# EAGLE design power-module (EAGLE 8.3.1)
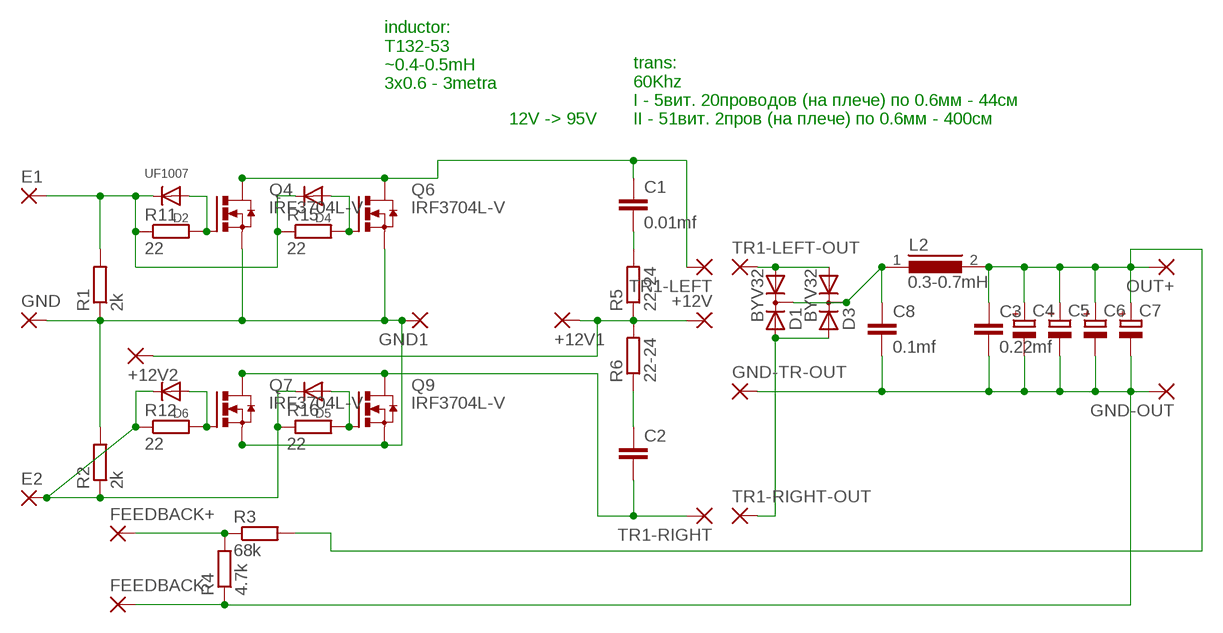
[diagram p0: schematic, sheet 1]

## Parts
+12V  3,81/1,1  [3,81/1,1]
+12V1  3,81/1,1  [3,81/1,1]
+12V2  3,81/1,1  [3,81/1,1]
C1  0.01mf  C-EU102-064X133  [C102-064X133]
C2  C-EU102-064X133  [C102-064X133]
C3  0.22mf  C-EU150-064X183  [C150-064X183]
C4  CPOL-EUE10-22.5  [EB22,5D]
C5  CPOL-EUE10-22.5  [EB22,5D]
C6  CPOL-EUE10-22.5  [EB22,5D]
C7  CPOL-EUE10-22.5  [EB22,5D]
C8  0.1mf  C-EU150-064X183  [C150-064X183]
D1  BYV32  [TO220ABS]
D2  UF1007  DIODEDO-1N4148  [DO-1N4148]
D3  BYV32  [TO220ABS]
D4  DIODEDO-1N4148  [DO-1N4148]
D5  DIODEDO-1N4148  [DO-1N4148]
D6  DIODEDO-1N4148  [DO-1N4148]
E1  3,81/1,1  [3,81/1,1]
E2  3,81/1,1  [3,81/1,1]
FEEDBACK+  3,81/1,1  [3,81/1,1]
FEEDBACK-  3,81/1,1  [3,81/1,1]
GND  3,81/1,1  [3,81/1,1]
GND1  3,81/1,1  [3,81/1,1]
GND-OUT  3,81/1,1  [3,81/1,1]
GND-TR-OUT  3,81/1,1  [3,81/1,1]
L2  0.3-0.7mH  R2711F11  [11-27]
OUT+  3,81/1,1  [3,81/1,1]
Q4  IRF3704L-V  [TO262-V]
Q6  IRF3704L-V  [TO262-V]
Q7  IRF3704L-V  [TO262-V]
Q9  IRF3704L-V  [TO262-V]
R1  2k  R-EU_0204/7  [0204/7]
R2  2k  R-EU_0204/7  [0204/7]
R3  68k  R-EU_0617/17  [0617/17]
R4  4.7k  R-EU_0617/17  [0617/17]
R5  22-24  R-EU_0613/15  [P0613/15]
R6  22-24  R-EU_0613/15  [P0613/15]
R11  22  R-EU_0204/7  [0204/7]
R12  22  R-EU_0204/7  [0204/7]
R15  22  R-EU_0204/7  [0204/7]
R16  22  R-EU_0204/7  [0204/7]
TR1-LEFT  3,81/1,1  [3,81/1,1]
TR1-LEFT-OUT  3,81/1,1  [3,81/1,1]
TR1-RIGHT  3,81/1,1  [3,81/1,1]
TR1-RIGHT-OUT  3,81/1,1  [3,81/1,1]

## Nets
N$1: GND1.1(P) GND.1(P) Q4.3(S) Q6.3(S) Q7.3(S) Q9.3(S) R1.1 R2.2
N$2: C1.1 Q4.2(D) Q6.2(D) TR1-LEFT.1(P)
N$3: D5.C D6.C E2.1(P) R2.1 R12.1 R16.1
N$4: FEEDBACK+.1(P) R3.1 R4.2
N$5: +12V1.1(P) +12V2.1(P) +12V.1(P) R5.1 R6.2
N$6: C3.2 C4.- C5.- C6.- C7.- C8.2 FEEDBACK-.1(P) GND-OUT.1(P) GND-TR-OUT.1(P) R4.1
N$7: C2.2 Q7.2(D) Q9.2(D) TR1-RIGHT.1(P)
N$9: D2.C D4.C E1.1(P) R1.2 R11.1 R15.1
N$11: C1.2 R5.2
N$12: D1.A2 D3.A2 TR1-RIGHT-OUT.1(P)
N$13: C2.1 R6.1
N$14: D1.A1 D3.A1 TR1-LEFT-OUT.1(P)
N$15: C8.1 D1.C D3.C L2.1
N$17: C3.1 C4.+ C5.+ C6.+ C7.+ L2.2 OUT+.1(P) R3.2
N$18: D2.A Q4.1(G) R11.2
N$19: D6.A Q7.1(G) R12.2
N$22: D4.A Q6.1(G) R15.2
N$23: D5.A Q9.1(G) R16.2

## Notes on the sheet
- inductor:
  T132-53
  ~0.4-0.5mH
  3x0.6 - 3metra
- 12V -> 95V
- trans:
  60Khz
  I - 5вит. 20проводов (на плече) по 0.6мм - 44см
  II - 51вит. 2пров (на плече) по 0.6мм - 400см

## Library data of the parts
+12V +12V1 +12V2 E1 E2 FEEDBACK+ FEEDBACK- GND GND1 GND-OUT GND-TR-OUT OUT+ TR1-LEFT TR1-LEFT-OUT TR1-RIGHT TR1-RIGHT-OUT = wirepad:3,81/1,1: THROUGH-HOLE PAD
C1-C3 C8 = resistor:C-EU: CAPACITOR, European symbol
C4-C7 = resistor:CPOL-EU: POLARIZED CAPACITOR, European symbol
D1 D3 = diode:BYV32: DIODE 2 x Si diode 200 V, 20 A/230 Apeak, 25 ns
D2 D4-D6 = adafruit:DIODE: Diode SMADIODE - SMA Surface Mount Package 20V 1A Schottky Diode Digikey: 641-1014-6-ND DO-1N4148 - Through Hole Small Current Diode SOD-123 20V 1 A (.5mV Vf) Schottky Diode - Digikey: MBRX120TPMSCT-ND SOD-323 10V 570mA (.38mV Vf, 3ns) Schottky Diode - Digikey: ZLLS410CT-ND SOD-523 30V 30mA Schottky Diode (RB751S-40TE61) - Digikey: RB751S-40TE61CT-ND SOT23-R/W - SOT23 Package (R = Solder Paste/Reflow Ovens, W = Hand-Soldering) BAT54Film 40V 300mA - Digikey: 497-7162-1-ND
L2 = inductor-nkl:R2711F: Gegentakt-Entstördrossel differential mode choke; OC_FARNELL: unknown; OC_NEWARK: unknown
Q4 Q6 Q7 Q9 = transistor-power:IRF3704: SMPS MOSFET HEXFET® Power MOSFET Source: http://www.irf.com/product-info/datasheets/data/irf3704.pdf
R1-R6 R11 R12 R15 R16 = resistor:R-EU_: RESISTOR, European symbol

## Board
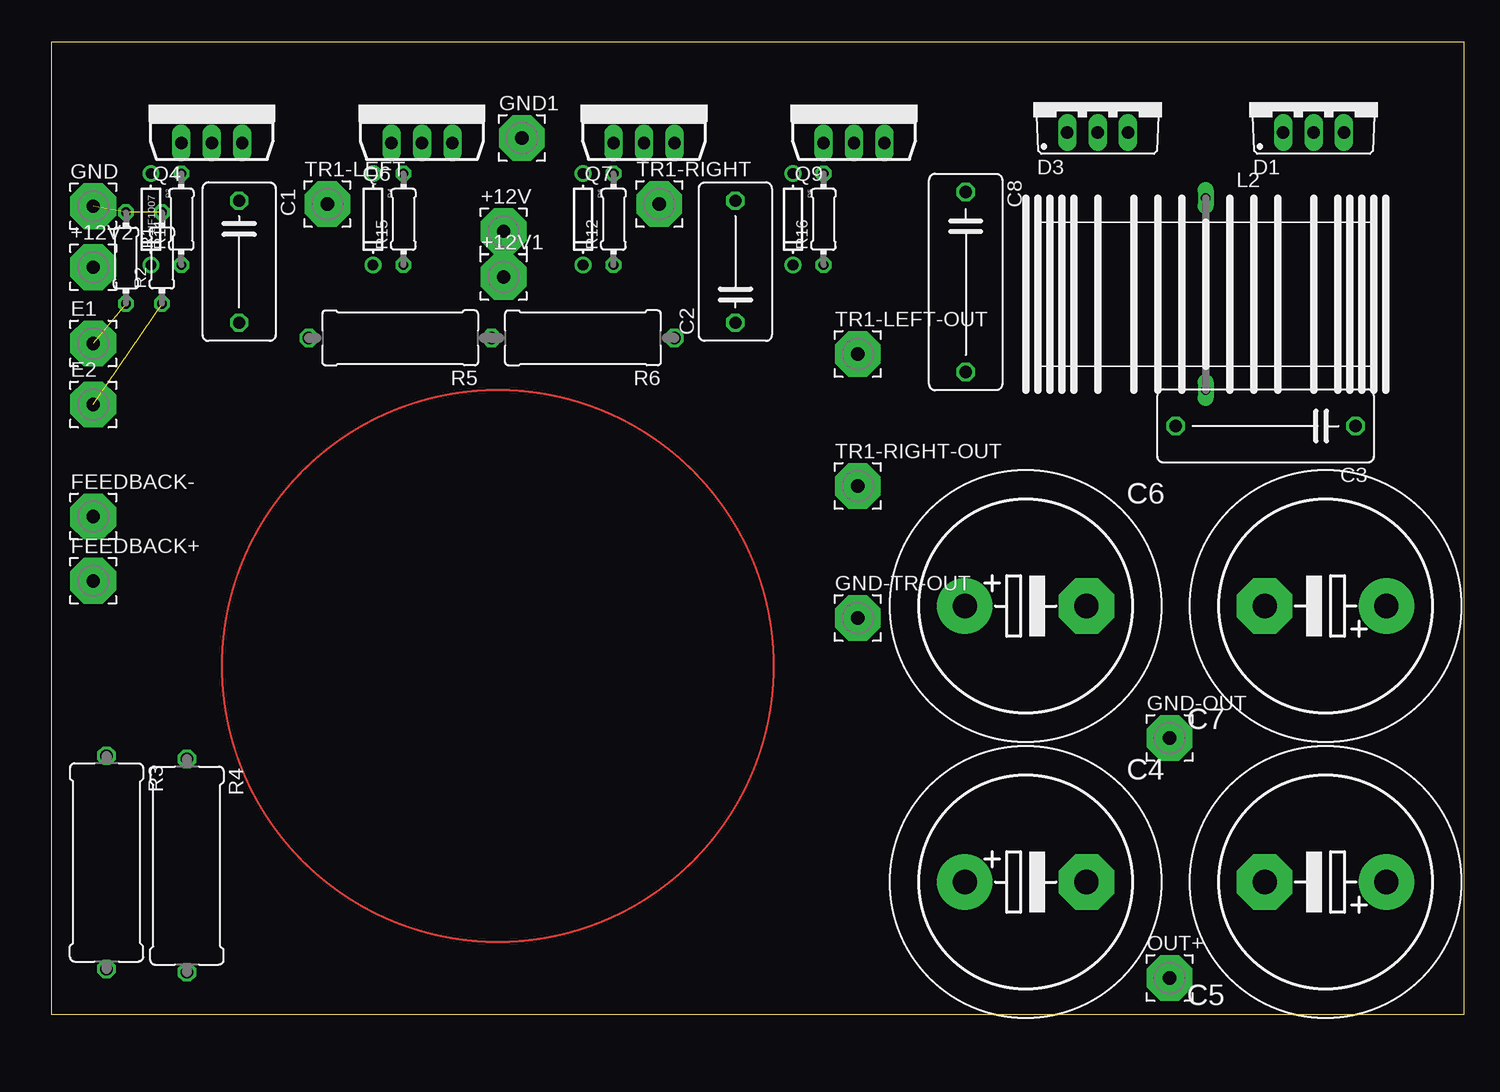
[diagram p1: board, top side]
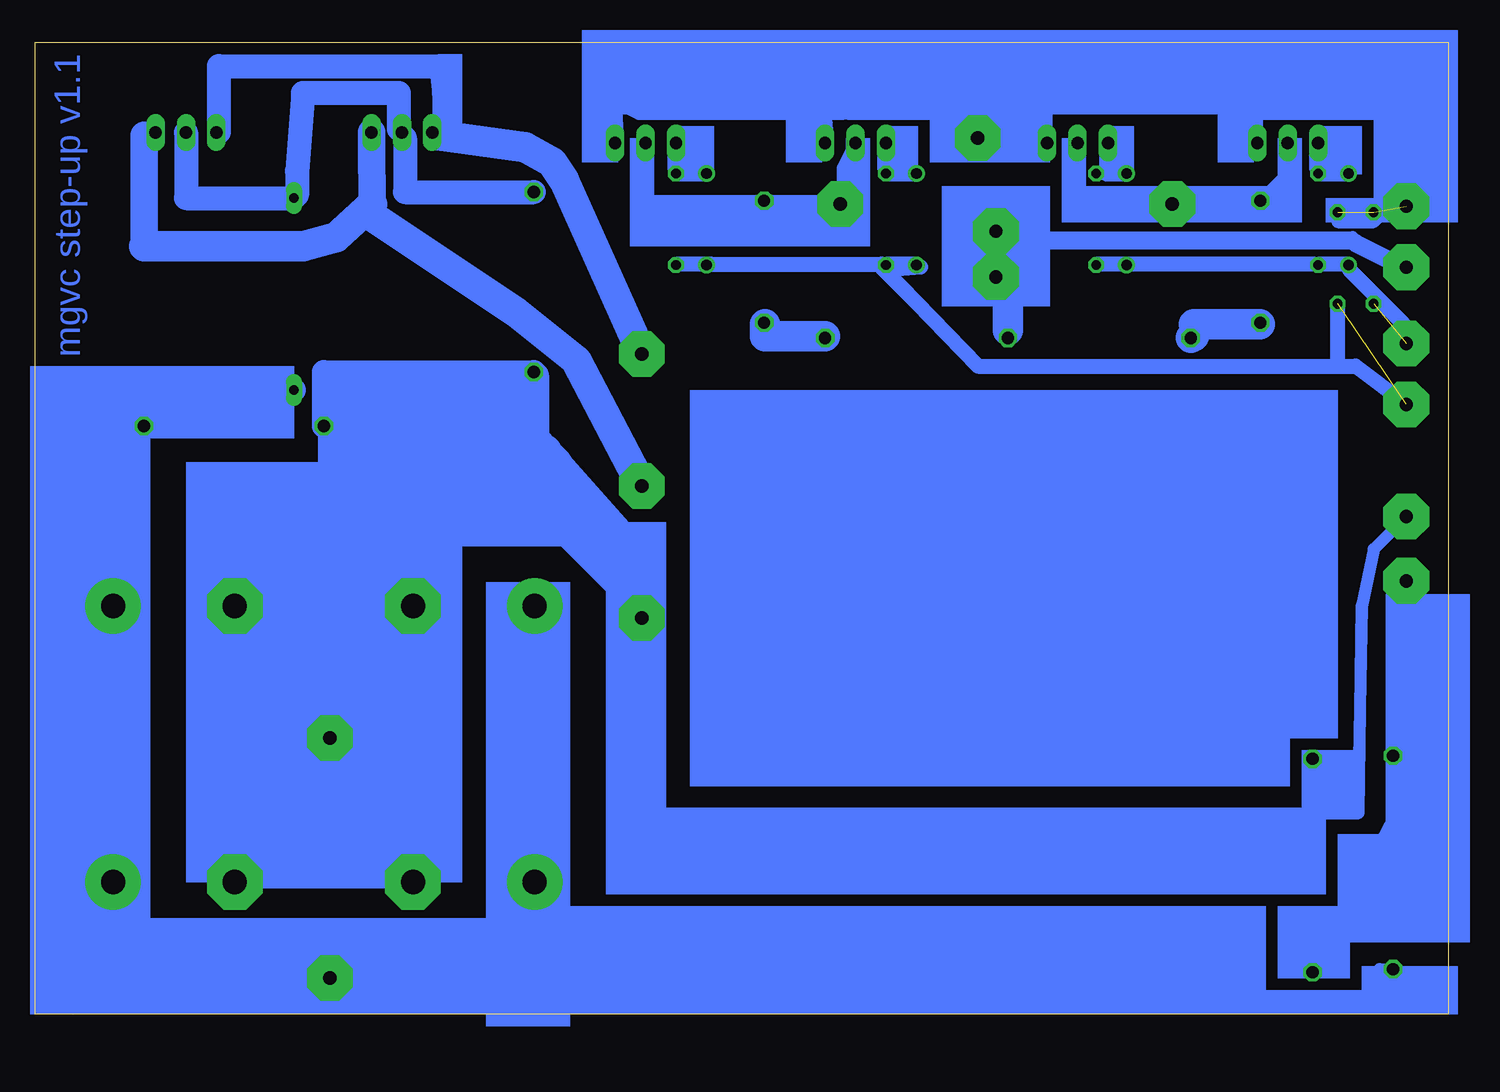
[diagram p2: board, bottom side, seen from below]

Size 117.8 x 81 mm. Coordinates in mm from the lower left corner, seen from the top.
Outline: 0,0 117.8,0 117.8,81 0,81 0,0
Copper layers (1*16): Top 0.035mm / dielectric 1.5mm / Bottom 0.035mm
Design rules "default *": minimum track width 1mm, minimum drill 0.35mm, track to track 6mil, track to pad 6mil, pad to pad 6mil, via to via 6mil, smd to smd 6mil, copper to edge 40mil, drill to drill 6mil, minimum pad ring 10mil, minimum via ring 8mil, stop-mask expansion 4mil, vias tented up to drill 0mil, thermal gap 10mil

### Footprints (pad centres in the part's own frame; a part is rotated, then mirrored left to right if it is on the bottom)
3,81/1,1 = drill 1.118 pad 3.81 octagon: 1 0,0
C102-064X133 = drill 1.016 octagon: 1 -5.08,0; 2 5.08,0
C150-064X183 = drill 1.016 octagon: 1 -7.493,0; 2 7.493,0
EB22,5D = drill 2.007 pad 4.597: + -5.08,0 | drill 2.007 pad 4.597 octagon: - 5.08,0
TO220ABS = drill 1.016 long: A1 -2.54,-2.54; A2 2.54,-2.54; C 0,-2.54
DO-1N4148 = drill 0.9: A -3.81,0; C 3.81,0
11-27 = drill 0.813 long: 1 -8,0; 2 8,0
TO262-V = drill 1.016 long: 1 -2.54,0; 2 0,0; 3 2.54,0
0204/7 = drill 0.813 octagon: 1 -3.81,0; 2 3.81,0
0617/17 = drill 1.016 octagon: 1 -8.89,0; 2 8.89,0
P0613/15 = drill 1.016 octagon: 1 -7.62,0; 2 7.62,0

### Placement (x,y rotation side)
+12V  37.72,65.23 0 top
+12V1  37.72,61.42 0 top
+12V2  3.51,62.23 0 top
C1  15.67,62.69 270 top
C2  57.04,62.69 90 top
C3  101.24,49 180 top
C4  81.24,11 0 top
C5  106.24,11 180 top
C6  81.24,34 0 top
C7  106.24,34 180 top
C8  76.24,61 270 top
D1  105.24,76 0 top
D2  8.32,66.23 270 top
D3  87.24,76 0 top
D4  26.83,66.23 270 top
D5  61.85,66.23 270 top
D6  44.34,66.23 270 top
E1  3.51,55.88 0 top
E2  3.51,50.8 0 top
FEEDBACK+  3.51,36.1 0 top
FEEDBACK-  3.51,41.45 0 top
GND  3.51,67.31 0 top
GND1  39.24,73 0 top
GND-OUT  93.24,23 0 top
GND-TR-OUT  67.24,33 0 top
L2  96.24,60 270 top
OUT+  93.24,3 0 top
Q4  13.4,72.58 0 top
Q6  30.91,72.58 0 top
Q7  49.42,72.58 0 top
Q9  66.93,72.58 0 top
R1  6.24,63 270 top
R2  9.24,63 90 top
R3  4.62,12.63 270 top
R4  11.32,12.37 270 top
R5  29.1,56.34 180 top
R6  44.34,56.34 180 top
R11  10.86,66.23 90 top
R12  46.88,66.23 90 top
R15  29.37,66.23 90 top
R16  64.39,66.23 90 top
TR1-LEFT  23.02,67.5 0 top
TR1-LEFT-OUT  67.24,55 0 top
TR1-RIGHT  50.69,67.5 0 top
TR1-RIGHT-OUT  67.24,44 0 top

### Tracks (layer width: path | path; a pad name or v marks a point on that pad's centre or on a via)
N$1  (2 unrouted)
  Bottom 1: GND.1 3.74,67.5 3.74,75 15.99,75 15.99,73.5 15.74,72.75 Q4.3 16.24,75.75 26.74,75.75 27.99,76 33.49,76 33.49,73.25 Q6.3 33.49,72.75 40.24,72.75 GND1.1 40.49,73.25 40.49,75 49.99,75 50.24,75.75 | 50.99,75 51.99,75.5 51.74,72.75 Q7.3 | 50.24,75.75 50.99,75 | 50.99,75 50.49,75 50.24,75.75 | 50.99,75 67.49,75 69.49,76 69.49,76.5 69.24,72.75 Q9.3
N$2
  Bottom 1: Q4.2 13.49,72.5 13.49,70 15.49,68 C1.1 15.99,67.75 22.74,67.75 TR1-LEFT.1 30.74,67.5 30.74,72.5 Q6.2
N$3  (1 unrouted)
  Bottom 1: 46.74,62.5 R12.1 47.24,62.5 | 44.49,62.5 D6.C | 64.24,62.5 R16.1 | 61.99,62.5 D5.C 61.49,62.5
  Bottom 1.016: 47.24,62 39.24,54
  Bottom 1.27: 44.49,62.5 46.74,62.5 | 61.99,62.5 64.24,62.5 | 61.49,62.5 47.24,62.5 | 9.24,54 39.24,54 46.99,62 43.99,62.25 D6.C | 9.24,54 7.74,54 E2.1 | 9.24,54 9.24,59
N$4
  Bottom 1: R3.1 4.49,22.5 4.49,16.5 R4.2 4.24,16 3.99,26.25 2.99,35.5 3.49,36 FEEDBACK+.1
N$5
  Bottom 1: 36.74,56.5 R6.2 36.74,57 | 36.74,61.25 +12V1.1 36.74,61.75 36.74,64.5 +12V.1 36.49,65 33.49,64.75 7.99,64.75 33.49,64.25 7.74,64.25 | 3.74,62.25 +12V2.1
  Bottom 1.5: 7.74,64.25 3.74,62.25
  Bottom 2.54: 36.74,61.25 36.74,57
N$6
  Bottom 1: C5.- 93.49,11 | 93.49,11 C4.- | 91.74,24.5 86.49,29.75 86.49,34 C6.- 85.99,34.25 85.49,45.75 74.49,46 74.24,46.25 | 91.74,24.5 GND-OUT.1 93.49,22.75 93.49,11 | C7.- 100.99,34 91.99,25 91.99,24.75 91.74,24.5 | 7.24,34 7.49,21.25 R4.1 | 7.24,34 6.24,38.75 3.74,41.25 FEEDBACK-.1 | C8.2 75.99,53.25 | C3.2 | GND-TR-OUT.1 66.99,32.75 66.99,16.75 7.49,16.75 7.24,34
  Bottom 2: C8.2 93.74,53.5 C3.2 | 66.99,32.75 69.99,40 74.24,46.25 75.99,48 75.99,53.25
N$7
  Bottom 1: Q7.2 49.49,72.5 50.49,70.5 50.49,66.5 TR1-RIGHT.1 50.74,67.75 56.99,67.75 C2.2 57.49,67.75 66.99,67.75 66.99,71.75 66.74,72.5 Q9.2
N$8
  Bottom 1.016: 9.24,66 6.24,66 4.24,68
N$9  (1 unrouted)
  Bottom 1: 29.24,62.5 R15.1 | 26.99,62.5 D4.C 26.49,62.5 | 10.74,62.5 R11.1 11.24,62.5 | 8.49,62.5 D2.C 8.24,62 | 3.74,56 E1.1
  Bottom 1.016: 6.24,59 6.24,60
  Bottom 1.27: 26.99,62.5 29.24,62.5 | 8.49,62.5 10.74,62.5 | 8.24,62 6.24,60 3.74,57.5 3.74,56 | 11.24,62.5 26.49,62.5
N$10
  Bottom 0.254: 68.24,39 72.24,42
  Bottom 2.54: 73.24,41 68.24,36 68.24,39 76.24,48 | 72.24,42 75.24,47
N$11
  Bottom 1: 21.24,56.5 21.24,57.5 | 15.74,57.5 C1.2
  Bottom 2.54: 21.24,57.5 15.74,57.5 | 21.24,56.5 R5.2
N$12
  Bottom 1: 89.74,67.5 89.74,66.5 | 108.74,73.25 D1.A2
  Bottom 2.3: 89.74,66.5 D3.A2 | 108.74,73.25 108.74,64
  Bottom 2.54: 89.74,67.5 92.74,64.75 95.49,64 108.74,64 | TR1-RIGHT-OUT.1 72.74,54.5 77.74,58.5 89.74,66.5
N$13
  Bottom 1: 51.99,56.5 R6.1 | 56.99,57.5 C2.1
  Bottom 2.54: 51.99,56.5 56.99,56.5 56.99,57.5
N$14
  Bottom 1: 83.74,74.5 D3.A1 84.24,73.25 | 102.49,73.5 D1.A1
  Bottom 2: 83.74,74.5 83.74,76.75 83.99,79 102.49,79 102.49,73.5
  Bottom 2.54: TR1-LEFT-OUT.1 73.74,69.5 74.74,71 76.99,72.25 84.24,73.25
N$15
  Bottom 1: 86.99,73 87.24,73.25 D3.C 87.49,73.75 | C8.1 | 95.99,68.25 L2.1
  Bottom 2: L2.1 105.24,68 D1.C | C8.1 86.99,68.5 86.99,73 | 95.99,68.25 95.99,70.25 95.49,76.75 87.49,76.75 87.49,73.75
N$16
  Bottom 2.54: 69.24,36 73.24,40
N$17
  Bottom 1: 108.49,49 C3.1 108.99,48.75 | 111.24,34 C7.+ 111.49,33.75 111.49,11 C5.+ 110.99,10.75 111.24,6.75 106.24,6.75 102.49,6 76.24,6 76.24,10.5 C4.+ | R3.2 5.74,3.75 5.49,1 OUT+.1 72.49,6.25 72.49,5 C4.+ | C6.+ 76.24,34 76.24,11.25 C4.+
  Bottom 2: L2.2 108.49,52 108.49,49 | 108.99,48.75 111.24,46.5 111.24,34
N$18
  Bottom 1: 10.74,70 R11.2 10.99,70.5 | 8.49,70 D2.A | 10.99,72.5 Q4.1
  Bottom 1.27: 8.49,70 10.74,70 | 10.99,70.5 10.99,72.5
N$19
  Bottom 1: 46.74,70 R12.2 46.99,70.5 | 44.49,70 D6.A | 46.99,72.5 Q7.1
  Bottom 1.27: 44.49,70 46.74,70 | 46.99,70.5 46.99,72.5
N$20
  Bottom 2.54: 67.24,38 75.24,45
N$22
  Bottom 1: 28.49,70 29.24,70 R15.2 | 26.99,70 D4.A | 28.49,72.5 Q6.1
  Bottom 1.27: 26.99,70 28.49,70 28.49,72.5
N$23
  Bottom 1: 64.24,70 R16.2 64.49,70.5 | 61.99,70 D5.A | 64.49,72.5 Q9.1
  Bottom 1.27: 61.99,70 64.24,70 | 64.49,70.5 64.49,72.5
(copper drawn outside any net)
  shapes: Bottom area x71, Top circle x1

### Text on the board
Bottom: mgvc step-up v1.1 | mgvc step-up v1.0